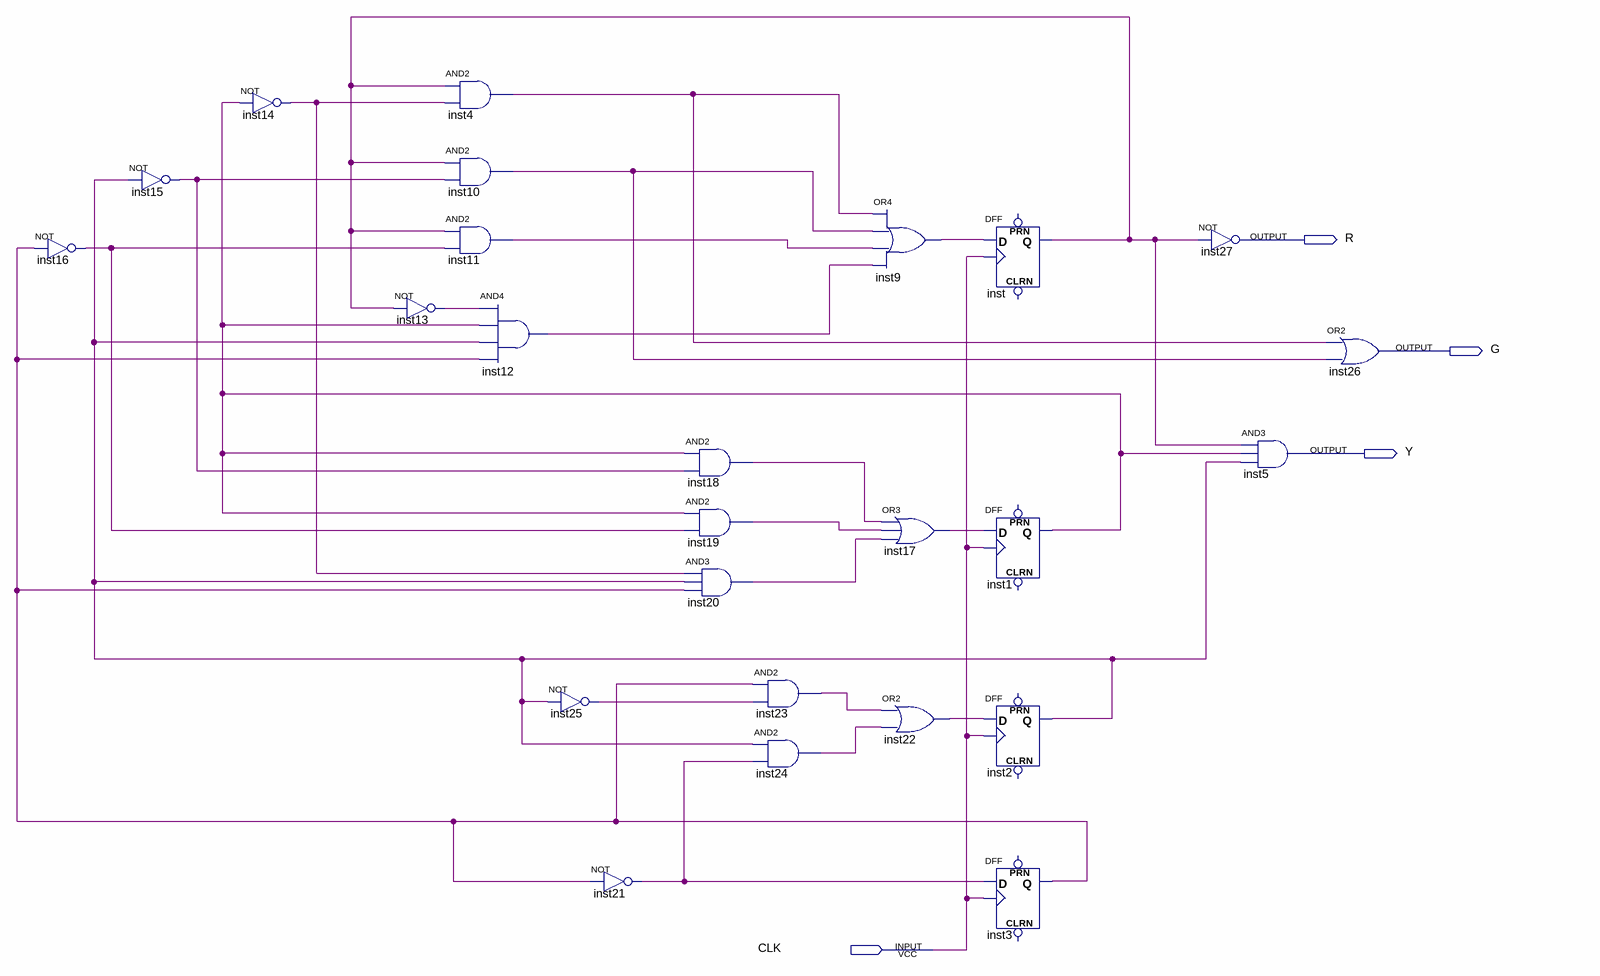
[diagram p0: schematic sheet]
// Quartus schematic SIG16.bdf as structural Verilog: 25 symbols, 4 pins
module SIG16 (
  input  CLK,
  output R,
  output G,
  output Y
);

  wire inst1_q, inst2_q, inst3_q, inst4_out, inst9_out, inst10_out, inst11_out, inst12_out, inst13_out,
       inst14_out, inst15_out, inst16_out, inst17_out, inst18_out, inst19_out, inst20_out, inst21_out,
       inst22_out, inst23_out, inst24_out, inst25_out, inst_q;

  not inst16 (inst16_out, inst3_q);
  not inst15 (inst15_out, inst2_q);
  not inst14 (inst14_out, inst1_q);
  and inst4 (inst4_out, inst_q, inst14_out);
  and inst10 (inst10_out, inst_q, inst15_out);
  and inst11 (inst11_out, inst_q, inst16_out);
  not inst13 (inst13_out, inst_q);
  and inst12 (inst12_out, inst13_out, inst1_q, inst2_q, inst3_q);
  not inst25 (inst25_out, inst2_q);
  not inst21 (inst21_out, inst3_q);
  and inst18 (inst18_out, inst1_q, inst15_out);
  and inst19 (inst19_out, inst1_q, inst16_out);
  and inst20 (inst20_out, inst14_out, inst2_q, inst3_q);
  and inst23 (inst23_out, inst3_q, inst25_out);
  and inst24 (inst24_out, inst2_q, inst21_out);
  or inst9 (inst9_out, inst4_out, inst10_out, inst11_out, inst12_out);
  or inst17 (inst17_out, inst18_out, inst19_out, inst20_out);
  or inst22 (inst22_out, inst23_out, inst24_out);
  DFF inst (.CLK(CLK), .D(inst9_out), .Q(inst_q));  // open: CLRN, PRN
  DFF inst1 (.CLK(CLK), .D(inst17_out), .Q(inst1_q));  // open: CLRN, PRN
  DFF inst2 (.CLK(CLK), .D(inst22_out), .Q(inst2_q));  // open: CLRN, PRN
  DFF inst3 (.CLK(CLK), .D(inst21_out), .Q(inst3_q));  // open: CLRN, PRN
  not inst27 (R, inst_q);
  and inst5 (Y, inst_q, inst1_q, inst2_q);
  or inst26 (G, inst4_out, inst10_out);
endmodule
